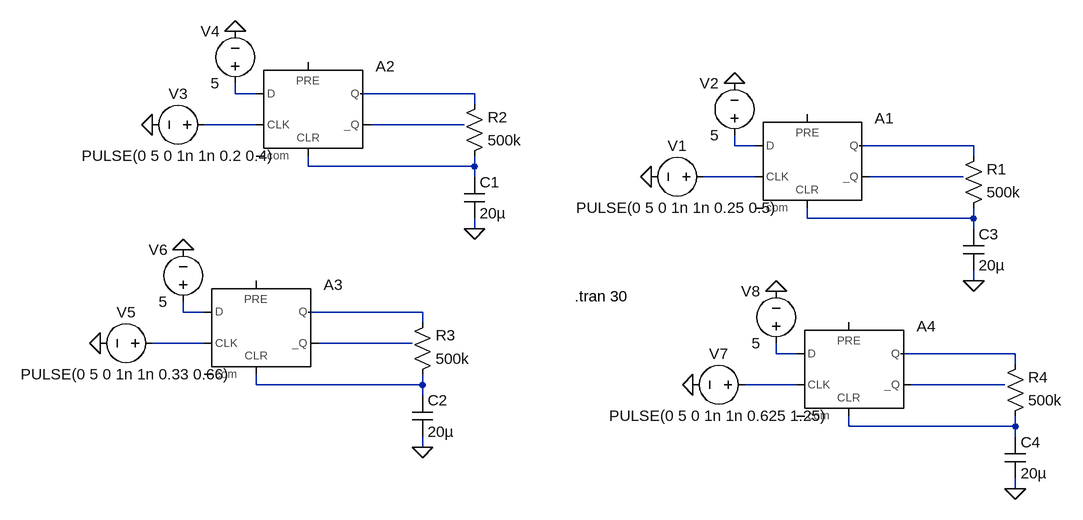
[diagram p0: schematic dflipflop.asc]
dflipflop.asc, the LTspice schematic file:
Version 4
SHEET 1 2292 680
WIRE -2192 -1056 -2192 -1072
WIRE -2160 -1056 -2192 -1056
WIRE -1824 -1056 -2000 -1056
WIRE -1824 -1040 -1824 -1056
WIRE -2160 -1008 -2240 -1008
WIRE -1840 -1008 -1984 -1008
WIRE -1424 -976 -1424 -992
WIRE -1392 -976 -1424 -976
WIRE -1056 -976 -1232 -976
WIRE -1056 -960 -1056 -976
WIRE -2080 -944 -2080 -960
WIRE -1824 -944 -1824 -960
WIRE -1824 -944 -2080 -944
WIRE -1824 -928 -1824 -944
WIRE -1392 -928 -1472 -928
WIRE -1072 -928 -1216 -928
WIRE -1312 -864 -1312 -880
WIRE -1056 -864 -1056 -880
WIRE -1056 -864 -1312 -864
WIRE -1824 -848 -1824 -864
WIRE -1056 -848 -1056 -864
WIRE -1056 -768 -1056 -784
WIRE -2272 -720 -2272 -736
WIRE -2240 -720 -2272 -720
WIRE -1904 -720 -2080 -720
WIRE -1904 -704 -1904 -720
WIRE -2240 -672 -2320 -672
WIRE -1920 -672 -2064 -672
WIRE -1360 -656 -1360 -672
WIRE -1328 -656 -1360 -656
WIRE -992 -656 -1168 -656
WIRE -992 -640 -992 -656
WIRE -2160 -608 -2160 -624
WIRE -1904 -608 -1904 -624
WIRE -1904 -608 -2160 -608
WIRE -1328 -608 -1408 -608
WIRE -1008 -608 -1152 -608
WIRE -1904 -592 -1904 -608
WIRE -1248 -544 -1248 -560
WIRE -992 -544 -992 -560
WIRE -992 -544 -1248 -544
WIRE -992 -528 -992 -544
WIRE -1904 -512 -1904 -528
WIRE -992 -448 -992 -464
FLAG -1056 -768 0
FLAG -1552 -928 0
FLAG -1424 -1072 0
FLAG -1824 -848 0
FLAG -2320 -1008 0
FLAG -2192 -1152 0
FLAG -1904 -512 0
FLAG -2400 -672 0
FLAG -2272 -816 0
FLAG -992 -448 0
FLAG -1488 -608 0
FLAG -1360 -752 0
SYMBOL Digital\\dflop -1312 -1024 R0
SYMATTR InstName A1
SYMATTR SpiceLine Vhigh 5 Trise 10n
SYMBOL res -1072 -864 M180
WINDOW 0 36 76 Left 2
WINDOW 3 36 40 Left 2
SYMATTR InstName R1
SYMATTR Value 500k
SYMBOL cap -1072 -848 R0
SYMATTR InstName C3
SYMATTR Value 20µ
SYMBOL voltage -1456 -928 R90
WINDOW 0 -32 56 VBottom 2
WINDOW 3 32 56 VTop 2
WINDOW 123 0 0 Left 0
WINDOW 39 0 0 Left 0
SYMATTR InstName V1
SYMATTR Value PULSE(0 5 0 1n 1n 0.25 0.5)
SYMBOL voltage -1424 -976 R180
WINDOW 0 24 96 Left 2
WINDOW 3 24 16 Left 2
WINDOW 123 0 0 Left 0
WINDOW 39 0 0 Left 0
SYMATTR InstName V2
SYMATTR Value 5
SYMBOL Digital\\dflop -2080 -1104 R0
SYMATTR InstName A2
SYMATTR SpiceLine Vhigh 5 Trise 10n
SYMBOL res -1840 -944 M180
WINDOW 0 36 76 Left 2
WINDOW 3 36 40 Left 2
SYMATTR InstName R2
SYMATTR Value 500k
SYMBOL cap -1840 -928 R0
SYMATTR InstName C1
SYMATTR Value 20µ
SYMBOL voltage -2224 -1008 R90
WINDOW 0 -32 56 VBottom 2
WINDOW 3 32 56 VTop 2
WINDOW 123 0 0 Left 0
WINDOW 39 0 0 Left 0
SYMATTR InstName V3
SYMATTR Value PULSE(0 5 0 1n 1n 0.2 0.4)
SYMBOL voltage -2192 -1056 R180
WINDOW 0 24 96 Left 2
WINDOW 3 24 16 Left 2
WINDOW 123 0 0 Left 0
WINDOW 39 0 0 Left 0
SYMATTR InstName V4
SYMATTR Value 5
SYMBOL Digital\\dflop -2160 -768 R0
SYMATTR InstName A3
SYMATTR SpiceLine Vhigh 5 Trise 10n
SYMBOL res -1920 -608 M180
WINDOW 0 36 76 Left 2
WINDOW 3 36 40 Left 2
SYMATTR InstName R3
SYMATTR Value 500k
SYMBOL cap -1920 -592 R0
SYMATTR InstName C2
SYMATTR Value 20µ
SYMBOL voltage -2304 -672 R90
WINDOW 0 -32 56 VBottom 2
WINDOW 3 32 56 VTop 2
WINDOW 123 0 0 Left 0
WINDOW 39 0 0 Left 0
SYMATTR InstName V5
SYMATTR Value PULSE(0 5 0 1n 1n 0.33 0.66)
SYMBOL voltage -2272 -720 R180
WINDOW 0 24 96 Left 2
WINDOW 3 24 16 Left 2
WINDOW 123 0 0 Left 0
WINDOW 39 0 0 Left 0
SYMATTR InstName V6
SYMATTR Value 5
SYMBOL Digital\\dflop -1248 -704 R0
SYMATTR InstName A4
SYMATTR SpiceLine Vhigh 5 Trise 10n
SYMBOL res -1008 -544 M180
WINDOW 0 36 76 Left 2
WINDOW 3 36 40 Left 2
SYMATTR InstName R4
SYMATTR Value 500k
SYMBOL cap -1008 -528 R0
SYMATTR InstName C4
SYMATTR Value 20µ
SYMBOL voltage -1392 -608 R90
WINDOW 0 -32 56 VBottom 2
WINDOW 3 32 56 VTop 2
WINDOW 123 0 0 Left 0
WINDOW 39 0 0 Left 0
SYMATTR InstName V7
SYMATTR Value PULSE(0 5 0 1n 1n 0.625 1.25)
SYMBOL voltage -1360 -656 R180
WINDOW 0 24 96 Left 2
WINDOW 3 24 16 Left 2
WINDOW 123 0 0 Left 0
WINDOW 39 0 0 Left 0
SYMATTR InstName V8
SYMATTR Value 5
TEXT -1670 -744 Left 2 !.tran 30

The netlist it stands for:
* dflipflop.asc
A1 N005 0 N008 0 N010 N009 N006 0 DFLOP Vhigh 5 Trise 10n
R1 N010 N006 500k
C3 N010 0 20µ
V1 N008 0 PULSE(0 5 0 1n 1n 0.25 0.5)
V2 N005 0 5
A2 N001 0 N003 0 N007 N004 N002 0 DFLOP Vhigh 5 Trise 10n
R2 N007 N002 500k
C1 N007 0 20µ
V3 N003 0 PULSE(0 5 0 1n 1n 0.2 0.4)
V4 N001 0 5
A3 N011 0 N013 0 N017 N014 N012 0 DFLOP Vhigh 5 Trise 10n
R3 N017 N012 500k
C2 N017 0 20µ
V5 N013 0 PULSE(0 5 0 1n 1n 0.33 0.66)
V6 N011 0 5
A4 N015 0 N018 0 N020 N019 N016 0 DFLOP Vhigh 5 Trise 10n
R4 N020 N016 500k
C4 N020 0 20µ
V7 N018 0 PULSE(0 5 0 1n 1n 0.625 1.25)
V8 N015 0 5
.tran 30
.backanno
.end